# EAGLE design BAM_SIMPLE_1U_6HP (EAGLE 6.6.0)
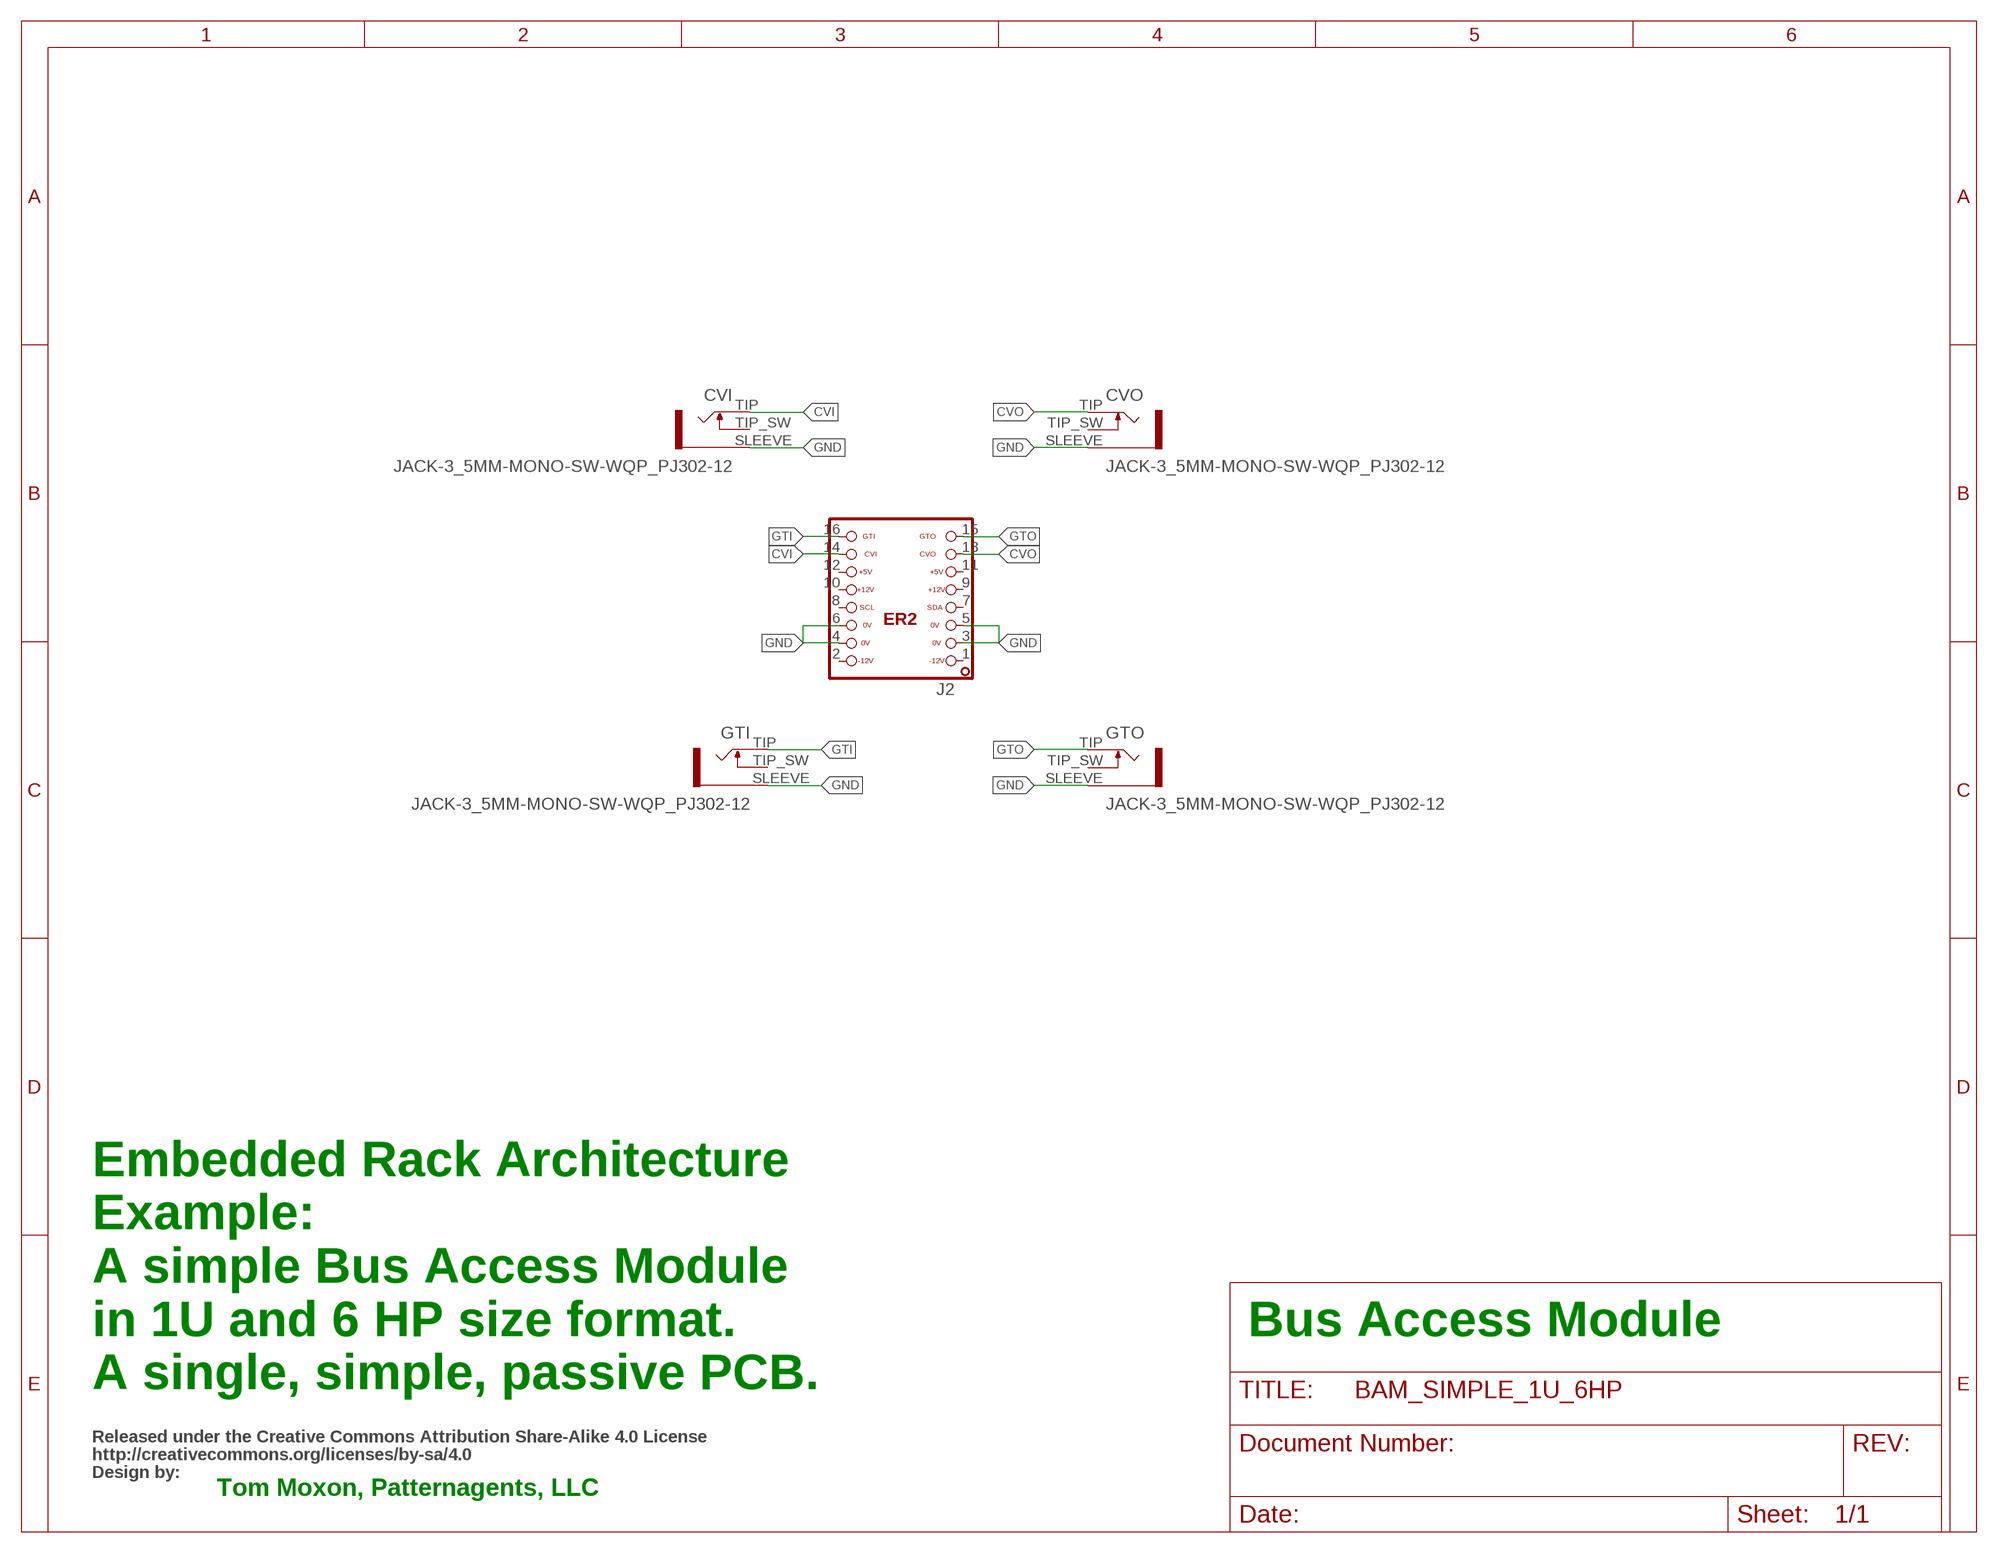
[diagram p0: schematic, sheet 1]

## Parts
CVI  JACK-3_5MM-MONO-SW-WQP_PJ302-12  [WQP_PJ301M-12]
CVO  JACK-3_5MM-MONO-SW-WQP_PJ302-12  [WQP_PJ301M-12]
GTI  JACK-3_5MM-MONO-SW-WQP_PJ302-12  [WQP_PJ301M-12]
GTO  JACK-3_5MM-MONO-SW-WQP_PJ302-12  [WQP_PJ301M-12]
J2  ER2-SHROUD  [ER2]
TOMMOXON  BY_CC_SA_TEXTNULL  [NULL_SYM]

## Nets
CVI: CVI.TIP J2.14
CVO: CVO.TIP J2.13
GND: CVI.SLEEVE CVO.SLEEVE GTI.SLEEVE GTO.SLEEVE J2.3 J2.4 J2.5 J2.6
GTI: GTI.TIP J2.16
GTO: GTO.TIP J2.15
Unconnected: CVI.TIP_SW CVO.TIP_SW GTI.TIP_SW GTO.TIP_SW J2.1 J2.2 J2.7 J2.8 J2.9 J2.10 J2.11 J2.12

## Notes on the sheet
- Bus Access Module
- Embedded Rack Architecture 
  Example:
  A simple Bus Access Module 
  in 1U and 6 HP size format.
  A single, simple, passive PCB.
- Tom Moxon, Patternagents, LLC

## Library data of the parts
CVI CVO GTI GTO = halcyonmod_Connectors:JACK-3_5MM-MONO-SW: Jack, 3.5mm, RIght Angle, Though-Hole
J2 = ERA:ER2: EuroRack2 - Backplane Connector
TOMMOXON = PatternAgents-Logos:BY_CC_SA_TEXT: BY_CC_SA_TEXT Source : http://wiki.creativecommons.org/CC_markers Github : https://github.com/PatternAgents/PCB_Libraries License : http://creativecommons.org/licenses/by-sa/4.0/ (Creative Commons 4.0) THIS SOFTWARE IS PROVIDED BY THE CONTRIBUTORS "AS IS" AND WITHOUT ANY EXPRESS OR IMPLIED WARRANTIES, INCLUDING, BUT NOT LIMITED TO, THE IMPLIED WARRANTIES OF MERCHANTABILITY AND FITNESS FOR A PARTICULAR PURPOSE ARE DISCLAIMED. IN NO EVENT SHALL THE COPYRIGHT OWNER OR CONTRIBUTORS BE LIABLE FOR ANY DIRECT, INDIRECT, INCIDENTAL, SPECIAL, EXEMPLARY, OR CONSEQUENTIAL DAMAGES (INCLUDING, BUT NOT LIMITED TO, PROCUREMENT OF SUBSTITUTE GOODS OR SERVICES; LOSS OF USE, DATA, OR PROFITS; OR BUSINESS INTERRUPTION) HOWEVER CAUSED AND ON ANY THEORY OF LIABILITY, WHETHER IN CONTRACT, STRICT LIABILITY, OR TORT (INCLUDING NEGLIGENCE OR OTHERWISE) ARISING IN ANY WAY OUT OF THE USE OF THIS SOFTWARE, EVEN IF ADVISED OF THE POSSIBILITY OF SUCH DAMAGE.

## Board
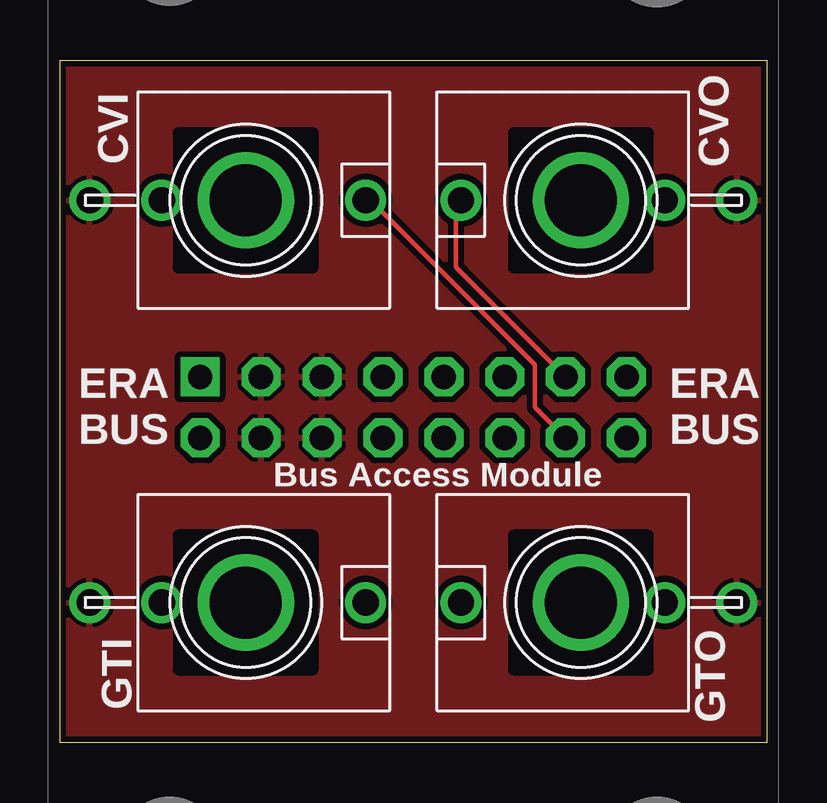
[diagram p1: board, top side]
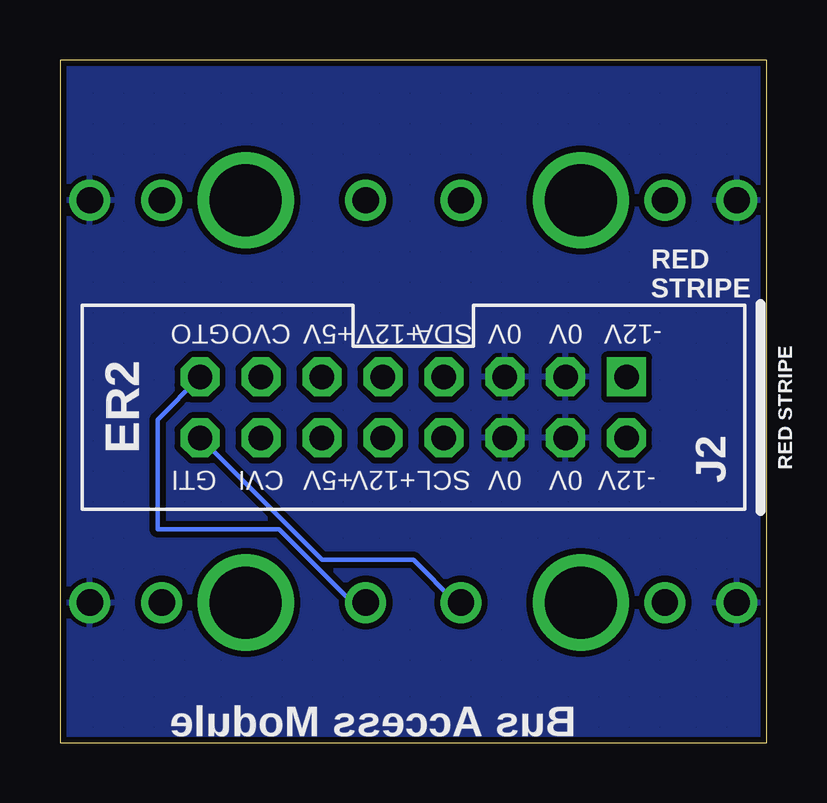
[diagram p2: board, bottom side, seen from below]

Size 29.46 x 28.45 mm. Coordinates in mm from the lower left corner, seen from the top.
Outline: 0,28.45 29.46,28.45 29.46,0 0,0 0,28.45
Copper layers (1*16): Top 0.035mm / dielectric 1.5mm / Bottom 0.035mm
Design rules "PatternAgents_7mil": minimum track width 7mil, minimum drill 14mil, track to track 7mil, track to pad 7mil, pad to pad 7mil, via to via 7mil, smd to smd 7mil, copper to edge 7mil, drill to drill 7mil, minimum pad ring 12mil, minimum via ring 10mil, stop-mask expansion 4mil, vias tented up to drill 25mil, thermal gap 7mil

### Footprints (pad centres in the part's own frame; a part is rotated, then mirrored left to right if it is on the bottom)
WQP_PJ301M-12 = drill 3: HOLE 0,0 | drill 1.1: SLEEVE 0,-6.5; TIP 0,5; TIP_SW 0,-3.5
ER2 = drill 1.016 square: 1 -8.89,-1.27 | drill 1.016 octagon: 2 -8.89,1.27; 3 -6.35,-1.27; 4 -6.35,1.27; 5 -3.81,-1.27; 6 -3.81,1.27; 7 -1.27,-1.27; 8 -1.27,1.27; 9 1.27,-1.27; 10 1.27,1.27; 11 3.81,-1.27; 12 3.81,1.27; 13 6.35,-1.27; 14 6.35,1.27; 15 8.89,-1.27; 16 8.89,1.27

### Placement (x,y rotation side)
CVI  7.75,22.61 270 top
CVO  21.72,22.61 90 top
GTI  7.75,5.84 270 top
GTO  21.72,5.84 90 top
J2  14.73,13.97 180 bottom
TOMMOXON  -0.51,-7.37 0 top  (outside the outline)

### Tracks (layer width: path | path; a pad name or v marks a point on that pad's centre or on a via)
CVI
  Top 0.178: J2.14 19.81,13.97 19.81,15.75 12.95,22.61 CVI.TIP
CVO
  Top 0.178: J2.13 16.51,19.81 16.51,22.61 CVO.TIP
GND
  pour Top (isolate 0.254, hatched): 0,28.45 29.46,28.45 29.46,0 0,0
  pour Bottom (isolate 0.254, hatched): 0,28.45 29.46,28.45 29.46,0 0,0
GTI
  Bottom 0.178: J2.16 18.54,7.62 14.73,7.62 12.95,5.84 GTI.TIP
GTO
  Bottom 0.178: J2.15 25.4,13.46 25.4,8.89 20.32,8.89 17.27,5.84 GTO.TIP

### Text on the board
tPlace: ERA / BUS | ERA / BUS | Bus Access Module
bPlace: RED / STRIPE | Bus Access Module